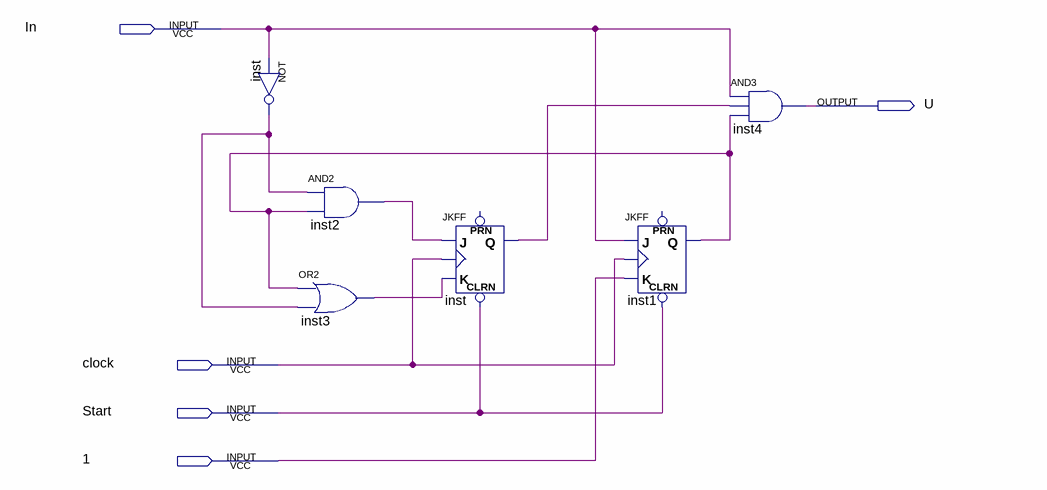
[diagram p0: schematic sheet]
// Quartus schematic block.bdf as structural Verilog: 6 symbols, 5 pins
module block (
  input  In,
  input  clock,
  input  Start,
  input  \1 ,
  output U
);

  wire inst1_q, inst2_out, inst3_out, inst_out, inst_q;

  not inst (inst_out, In);
  and inst2 (inst2_out, inst_out, inst1_q);
  or inst3 (inst3_out, inst1_q, inst_out);
  JKFF inst_dup2 (.CLRN(Start), .K(inst3_out), .J(inst2_out), .CLK(clock), .Q(inst_q));  // open: PRN
  JKFF inst1 (.CLRN(Start), .K(\1 ), .J(In), .CLK(clock), .Q(inst1_q));  // open: PRN
  and inst4 (U, In, inst_q, inst1_q);
endmodule
